# Altium schematic sheet Buck_converter.SchDoc: DC DC converter
size A4; Author: Sajitha Madugalle; Revision: 1; SheetNumber: 7; SheetTotal: 7
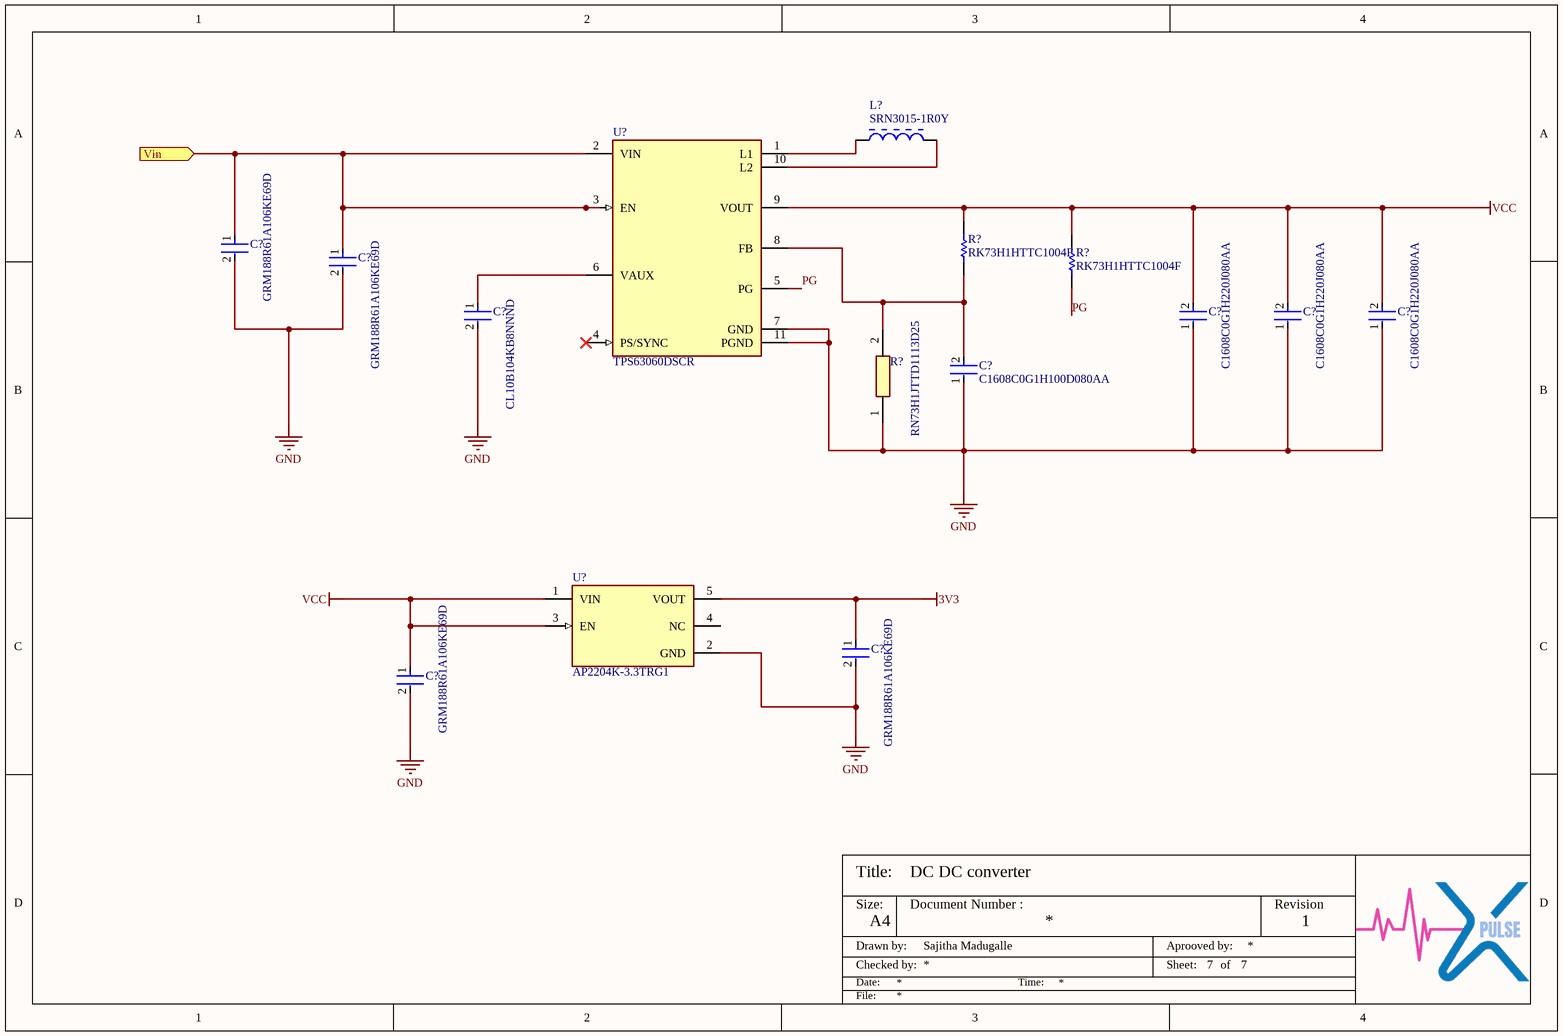
[diagram p0: Buck_converter.SchDoc]

## Parts
(Parts that share a designator on the sheet are numbered #1, #2 ... from top to bottom, then left to right.)
C?#1  GRM188R61A106KE69D  [FP-GRM18-0_15-MFG]
C?#2  GRM188R61A106KE69D  [FP-GRM18-0_15-MFG]
C?#3  CL10B104KB8NNND  [FP-CL10-IPC_A]
C?#4  C1608C0G1H220J080AA  [FP-C1608-080-0_1-IPC_B]
C?#5  C1608C0G1H220J080AA  [FP-C1608-080-0_1-IPC_B]
C?#6  C1608C0G1H220J080AA  [FP-C1608-080-0_1-IPC_B]
C?#7  C1608C0G1H100D080AA  [FP-C1608-080-0_1-IPC_C]
C?#8  GRM188R61A106KE69D  [FP-GRM18-0_15-MFG]
C?#9  GRM188R61A106KE69D  [FP-GRM18-0_15-MFG]
L?  SRN3015-1R0Y  [BOUR-SRN3015-2_V]
R?#1  RK73H1HTTC1004F  [RESC0603X26X15NL03T05]
R?#2  RK73H1HTTC1004F  [RESC0603X26X15NL03T05]
R?#3  RN73H1JTTD1113D25  [RESC1608X55N]
U?#1  TPS63060DSCR  [FP-DSC0010G-MFG]
U?#2  AP2204K-3.3TRG1  [FP-SOT25-IPC_C]

## Ports
Vin (in)

## Nets
3V3: C?#8.1 U?#2.5(VOUT)
GND: C?#1.2 C?#2.2 C?#3.2 C?#4.1 C?#5.1 C?#6.1 C?#7.1 C?#8.2 C?#9.2 R?#3.1 U?#1.7(GND) U?#1.11(PGND) U?#2.2(GND)
VCC: C?#4.2 C?#5.2 C?#6.2 C?#9.1 R?#1.2 R?#2.2 U?#1.9(VOUT) U?#2.1(VIN) U?#2.3(EN)
PG: R?#2.1 U?#1.5(PG)
Vin: C?#1.1 C?#2.1 U?#1.2(VIN) U?#1.3(EN) ; port Vin
NetC?#3_1: C?#3.1 U?#1.6(VAUX)
NetC?#7_2: C?#7.2 R?#1.1 R?#3.2 U?#1.8(FB)
NetL?_1: L?.1 U?#1.1(L1)
NetL?_2: L?.2 U?#1.10(L2)

Not connected (* = marked no-connect by the designer): U?#1 4(PS/SYNC)*; U?#2 4(NC)

## Notes on the sheet
- Title:
- Size:
- Document Number :
- Revision
- Drawn by:
- Checked by:
- Date:
- A4
- Time:
- Aprooved by:
- Sheet:
- of
- File:

## Library data of the parts
C?#1 C?#2 C?#8 C?#9 = CMP-2000-05448-2: CAP CER 10UF 10V X5R 0603; Manufacturer: Murata; Temperature Coefficient: 15%; Material: Ceramic; Tolerance: 10%; Device Class L1: Passive Components; ComponentLink2Description: Datasheet; Height: 0.95mm; Package: GRM18-0.15; Octopart: https://octopart.com/grm188r61a106ke69d-murata-22851381; Manufacturer Part Number: GRM188R61A106KE69D; Value: 10uF; Digikey Description: CAP CER 10UF 10V X5R 0603; Temperature Range High: +85°C; Temperature Range Low: -55°C; Temperature Characteristic: X5R; Capacitance: 10uF; RoHS: TRUE; Device Class L2: Capacitors; ComponentLink2URL: https://search.murata.co.jp/Ceramy/image/img/A01X/G101/ENG/GRM188R61A106KE69-01A.pdf; Device Class L3: Ceramic Capacitors; Lead Free: Yes; Mouser Description: Multilayer Ceramic Capacitors MLCC - SMD/SMT 0603 10uF 10volts X5R + - 10%; Category: Cap; Voltage Rating: 10V; Temperature: -55°C to +85°C; Automotive: No
C?#3 = CMP-13271-000587-1: Cap Ceramic 100nF 50V X7R ±10% Pad SMD 0603 +125°C T/R; Case/Package: 0603; Depth: 0.8mm; Max Operating Temperature: 125°C; Lead Free: Lead Free; Material: Ceramic; Voltage Rating: 50V; Min Operating Temperature: -55°C; Voltage Rating (DC): 50V; Dielectric: X7R; Height: 0.8mm; Capacitance: 100nF; Thickness: 0.035inch; Radiation Hardening: No; Voltage: 50V; Packaging: Tape and Reel; Length: 1.6mm; Tolerance: 10%; Width: 0.031inch; Mount: Surface Mount; Package Quantity: 10000
C?#4-C?#6 = CMP-2000-06024-2: CAP CER 22PF 50V C0G 0603; Tolerance: 5%; Temperature Coefficient: 30ppm/°C; Dielectric Material: Ceramic; Packaging: Tape and Reel; Termination: SMD/SMT; Case Code (Imperial): 0603; Height: 0.8mm; Capacitance: 22pF; Voltage: 50V; RoHS Compliant: Yes; Voltage Rating: 50V; Depth: 0.8mm; Case Code (Metric): 1608; Voltage Rating (DC): 50V; Construction: Flat; Max Operating Temperature: 125°C; Radiation Hardening: No; Lead Free: Lead Free; Number of Pins: 2; Case/Package: 0603; Thickness: 0.037inch; Min Operating Temperature: -55°C; Width: 0.031inch; Mount: Surface Mount; Weight: 7.1E-05oz; Series: C; Dielectric: C0G; Package Quantity: 1; Length: 1.6mm
C?#7 = CMP-08246-005843-1: Multilayer Ceramic Capacitors 10pF ±0.5pF 50V C0G SMD 0603; Temperature Coefficient: 30ppm/°C; Tolerance: 5%; Termination: SMD/SMT; REACH SVHC: No SVHC; Package Quantity: 1; Case Code (Imperial): 0603; Number of Pins: 2; Capacitance: 10pF; Length: 1.6mm; Thickness: 0.037inch; Weight: 7.1E-05oz; Voltage Rating (DC): 50V; RoHS Compliant: Yes; Width: 0.031inch; Depth: 0.8mm; Case/Package: 0603; Dielectric Material: Ceramic; Voltage: 50V; Min Operating Temperature: -55°C; Case Code (Metric): 1608; Mount: Surface Mount; Height: 0.8mm; Construction: Flat; Series: C; Packaging: Tape and Reel; Radiation Hardening: No; Max Operating Temperature: 125°C; Lead Free: Lead Free; Voltage Rating: 50V; Dielectric: C0G
L? = CMP-0007-00007-1: Semi-shielded Power Inductor, 1 uH, +/- 30%, 2.35 A, -40 to 125 degC, 3 x 3 x 1.5 mm SMD, RoHS and Halogen Free, Tape and Reel; Manufacturer: Bourns; Inductance tolerance: +/- 30%; DCR Max: 0.048 Ohm; Resistance to Solder Heat: +260 degC for 10 sec.; SRF Min: 145 MHz; Inductance: 1 uH; Isat: 2.35 A; ComponentLink3URL: http://www.bourns.com/data/global/pdfs/SRN3015.pdf; Packing: Tape and Reel; ComponentLink1Description: Manufacturer URL; DatasheetVersion: Aug-11; ComponentLink2URL: http://www.bourns.com/data/global/pdfs/SRN3015.pdf; PartNumber: SRN3015-1R0Y; ComponentLink3Description: Package Specification; RoHS: TRUE; Mounting Technology: Surface Mount; ComponentLink1URL: http://www.bourns.com/; Operating Temperature: -40 to 125 degC; Rated current: 2.35 A; PackageDescription: 2-Pin SMD, Body 3 x 3 mm, Height 1.5 mm; ComponentLink2Description: Datasheet; PackageReference: SRN3015
R?#1 R?#2 = CMP-2004-01565-1: Manufacturer: KOA Speer; Part Number: RK73H1HTTC1004F
R?#3 = RN73H1JTTD1113D25: Resistor; Manufacturer_Name: KOA Speer; Datasheet Link: https://www.mouser.com/datasheet/2/219/RN73H-12200.pdf; Height: 0.55mm; Manufacturer_Part_Number: RN73H1JTTD1113D25; Mouser Part Number: 660-RN73H1JTD1113D25; Mouser Price/Stock: https://www.mouser.co.uk/ProductDetail/KOA-Speer/RN73H1JTTD1113D25?qs=0hon8nwgHrb8JI0BK8RpbQ%3D%3D
U?#1 = CMP-04918-000043-1: IC REG BCK BST ADJ 2A 10WSON; Manufacturer: Texas Instruments; Standoff Height: 0mm; Switching Frequency: 2400kHz; Min Supply Voltage: 2.5V; Number Of Outputs: 1; Output Voltage: 2.5-8V; Max Junction Temp: +125°C; Nominal Supply Current: 30uA; Output Type: AdjustableProgrammable; Output Current: 1A; Max Supply Voltage: 12V; Max Duty Cycle: 100%; Switching Topology: Buck-Boost; Octopart: https://octopart.com/tps63060dscr-texas+instruments-21396306; ComponentLink2Description: Datasheet; Category: IC; Ambient Temperature Range High: +85°C; Ipc Land Pattern Name: DFN300X300X70-10; Automotive: No; Manufacturer Part Number: TPS63060DSCR; Mouser Description: Voltage Regulators - Switching Regulators 2.5-12Vin,2.25A Sw Crnt Limit; Lead Free: Yes; Digikey Description: IC REG BCK BST ADJ 2A 10WSON; Device Class L3: Voltage Regulators - Switching; Ambient Temperature Range Low: -40°C; Temperature: -40°C to +85°C; Package: DSC0010G; Device Class L2: Power Management ICs; Device Class L1: Integrated Circuits (ICs); ComponentLink2URL: http://www.ti.com/lit/ds/symlink/tps63060.pdf; Temperature Range High: +85°C; Height: 0.8mm; RoHS: TRUE; Temperature Range Low: -40°C
U?#2 = CMP-2000-05782-2: IC REG LINEAR 3.3V 150MA SOT23-5; Max Input Voltage: 24V; Min Input Voltage: 2.3V; Quiescent Current: 50uA; Number of Regulators: 1; Max Output Current: 250mA; Reference Voltage: 1.24V; Output Type: Fixed; Polarity: Positive; Dropout Voltage: 360mV; Weight: 0.001058oz; Min Operating Temperature: -40°C; Output Current: 150mA; Lead Free: Lead Free; Length: 3.02mm; Height: 1.3mm; Width: 1.7mm; Case/Package: SOT-23-5; Max Operating Temperature: 85°C; Package Quantity: 3000; Mount: Surface Mount; Output Voltage: 3.3V; Number of Pins: 5; Packaging: Tape and Reel; Number of Outputs: 1